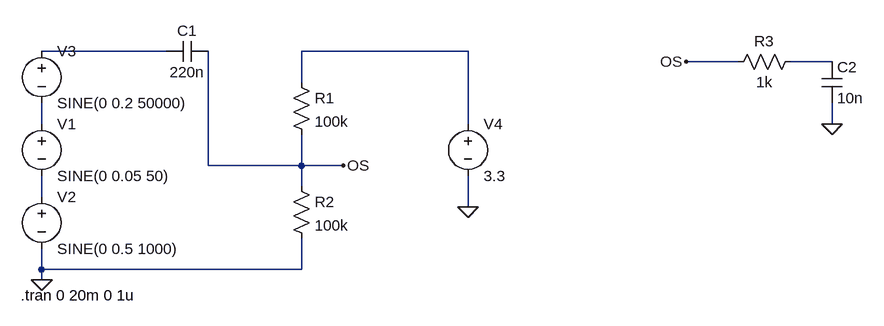
[diagram p0: schematic Offset_amplification.asc]
Offset_amplification.asc, the LTspice schematic file:
Version 4.1
SHEET 1 1256 680
WIRE 176 -128 -16 -128
WIRE 640 -128 384 -128
WIRE 1056 -112 976 -112
WIRE 1200 -112 1136 -112
WIRE 384 -80 384 -128
WIRE -16 -16 -16 -48
WIRE 640 -16 640 -128
WIRE 1200 -16 1200 -48
WIRE 240 48 240 -128
WIRE 384 48 384 0
WIRE 384 48 240 48
WIRE 448 48 384 48
WIRE 384 80 384 48
WIRE -16 96 -16 64
WIRE 640 112 640 64
WIRE -16 208 -16 176
WIRE 384 208 384 160
WIRE 384 208 -16 208
WIRE -16 224 -16 208
FLAG -16 224 0
FLAG 640 112 0
FLAG 448 48 OS
FLAG 976 -112 OS
FLAG 1200 -16 0
SYMBOL voltage -16 80 R0
WINDOW 123 0 0 Left 0
WINDOW 39 0 0 Left 0
SYMATTR InstName V2
SYMATTR Value SINE(0 0.5 1000)
SYMBOL voltage -16 -32 R0
WINDOW 123 0 0 Left 0
WINDOW 39 0 0 Left 0
SYMATTR InstName V1
SYMATTR Value SINE(0 0.05 50)
SYMBOL voltage -16 -144 R0
WINDOW 123 0 0 Left 0
WINDOW 39 0 0 Left 0
SYMATTR InstName V3
SYMATTR Value SINE(0 0.2 50000)
SYMBOL cap 240 -144 R90
WINDOW 0 0 32 VBottom 2
WINDOW 3 32 32 VTop 2
SYMATTR InstName C1
SYMATTR Value 220n
SYMBOL res 368 -96 R0
SYMATTR InstName R1
SYMATTR Value 100k
SYMBOL res 368 64 R0
SYMATTR InstName R2
SYMATTR Value 100k
SYMBOL voltage 640 -32 R0
WINDOW 123 0 0 Left 0
WINDOW 39 0 0 Left 0
SYMATTR InstName V4
SYMATTR Value 3.3
SYMBOL res 1152 -128 R90
WINDOW 0 0 56 VBottom 2
WINDOW 3 32 56 VTop 2
SYMATTR InstName R3
SYMATTR Value 1k
SYMBOL cap 1184 -112 R0
SYMATTR InstName C2
SYMATTR Value 10n
TEXT -48 248 Left 2 !.tran 0 20m 0 1u

The netlist it stands for:
* Offset_amplification.asc
V2 N005 0 SINE(0 0.5 1000)
V1 N004 N005 SINE(0 0.05 50)
V3 N001 N004 SINE(0 0.2 50000)
C1 OS N001 220n
R1 N002 OS 100k
R2 OS 0 100k
V4 N002 0 3.3
R3 N003 OS 1k
C2 N003 0 10n
.tran 0 20m 0 1u
.backanno
.end